# Altium schematic sheet SHA256.SchDoc
size A1
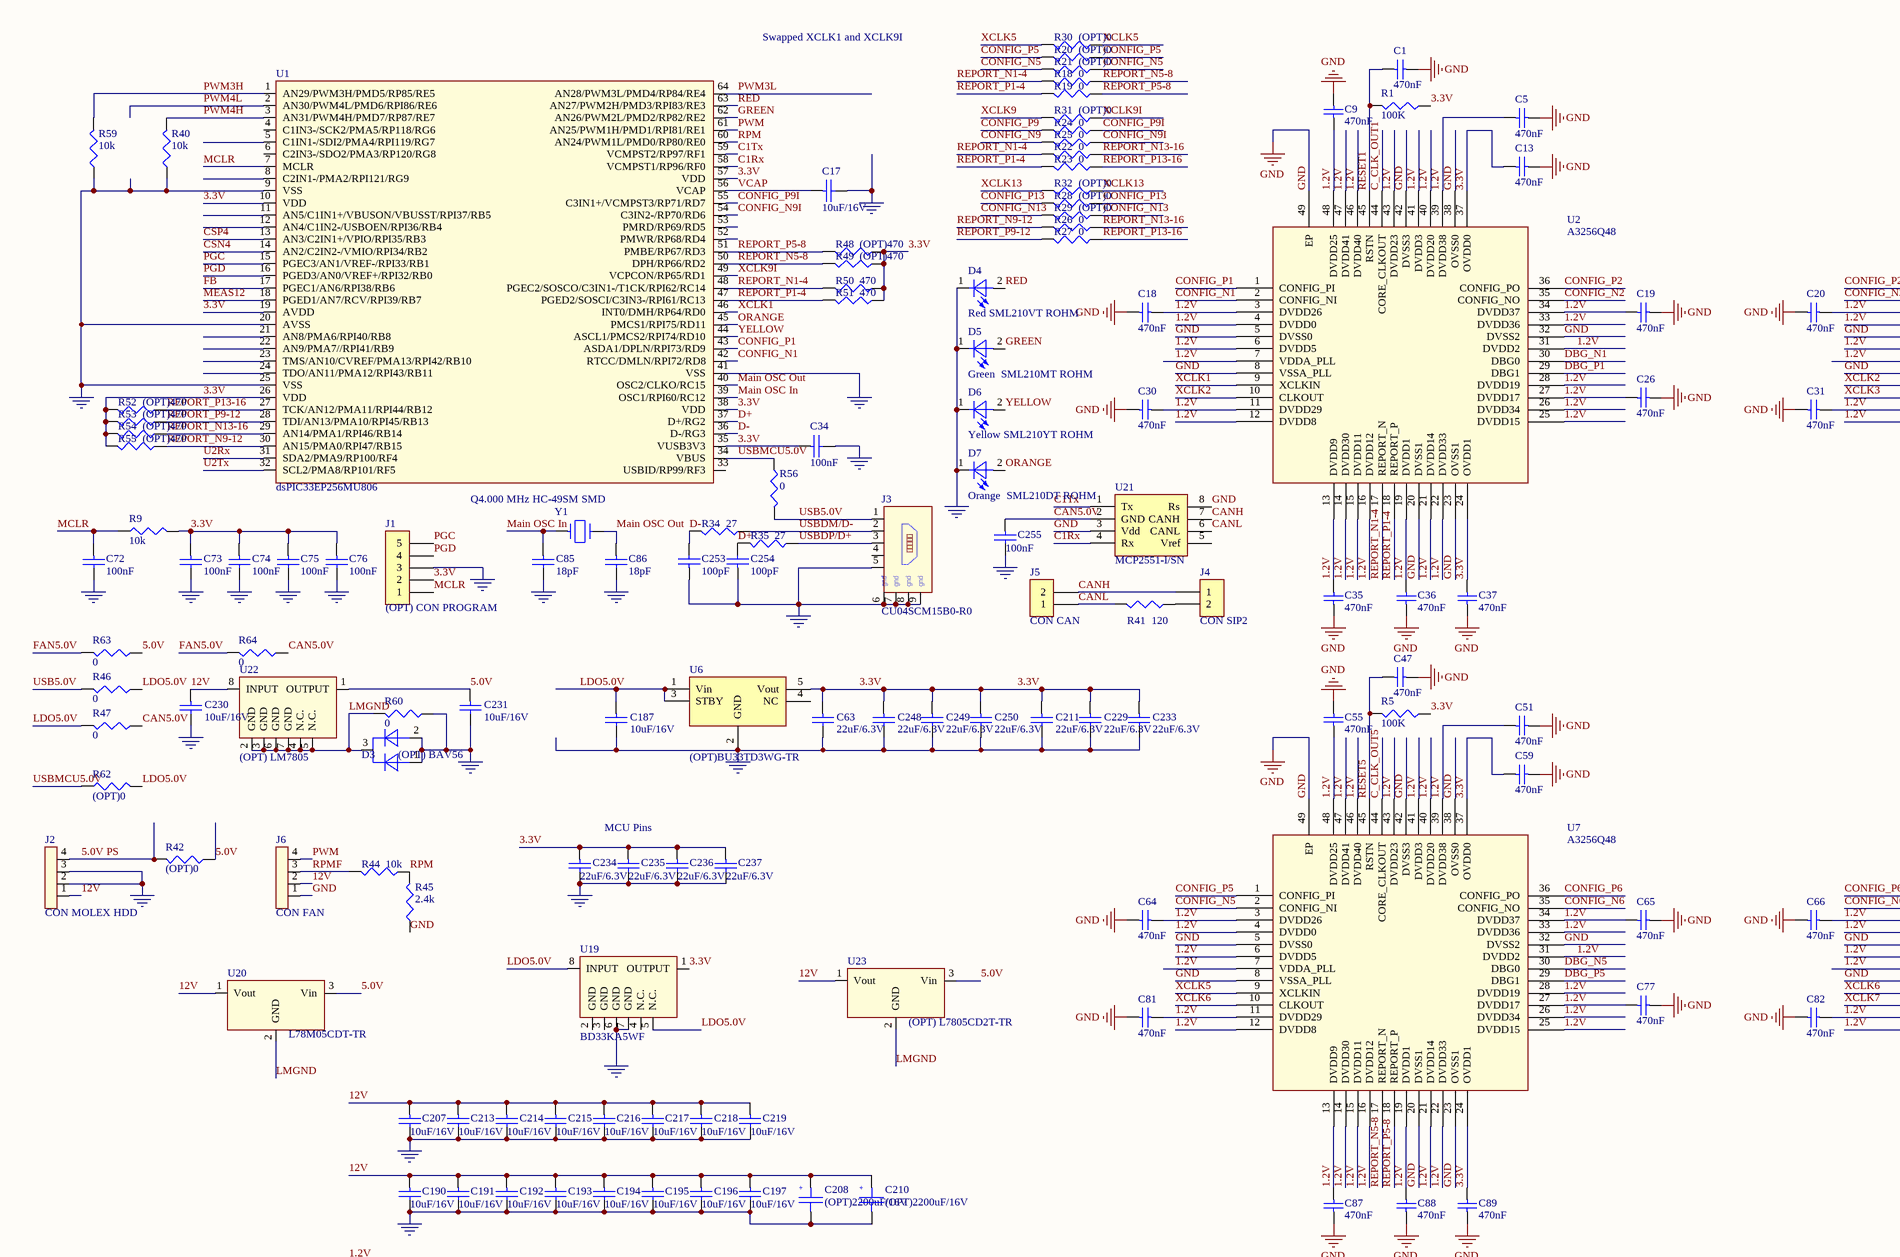
[diagram p0: SHA256.SchDoc, top left]
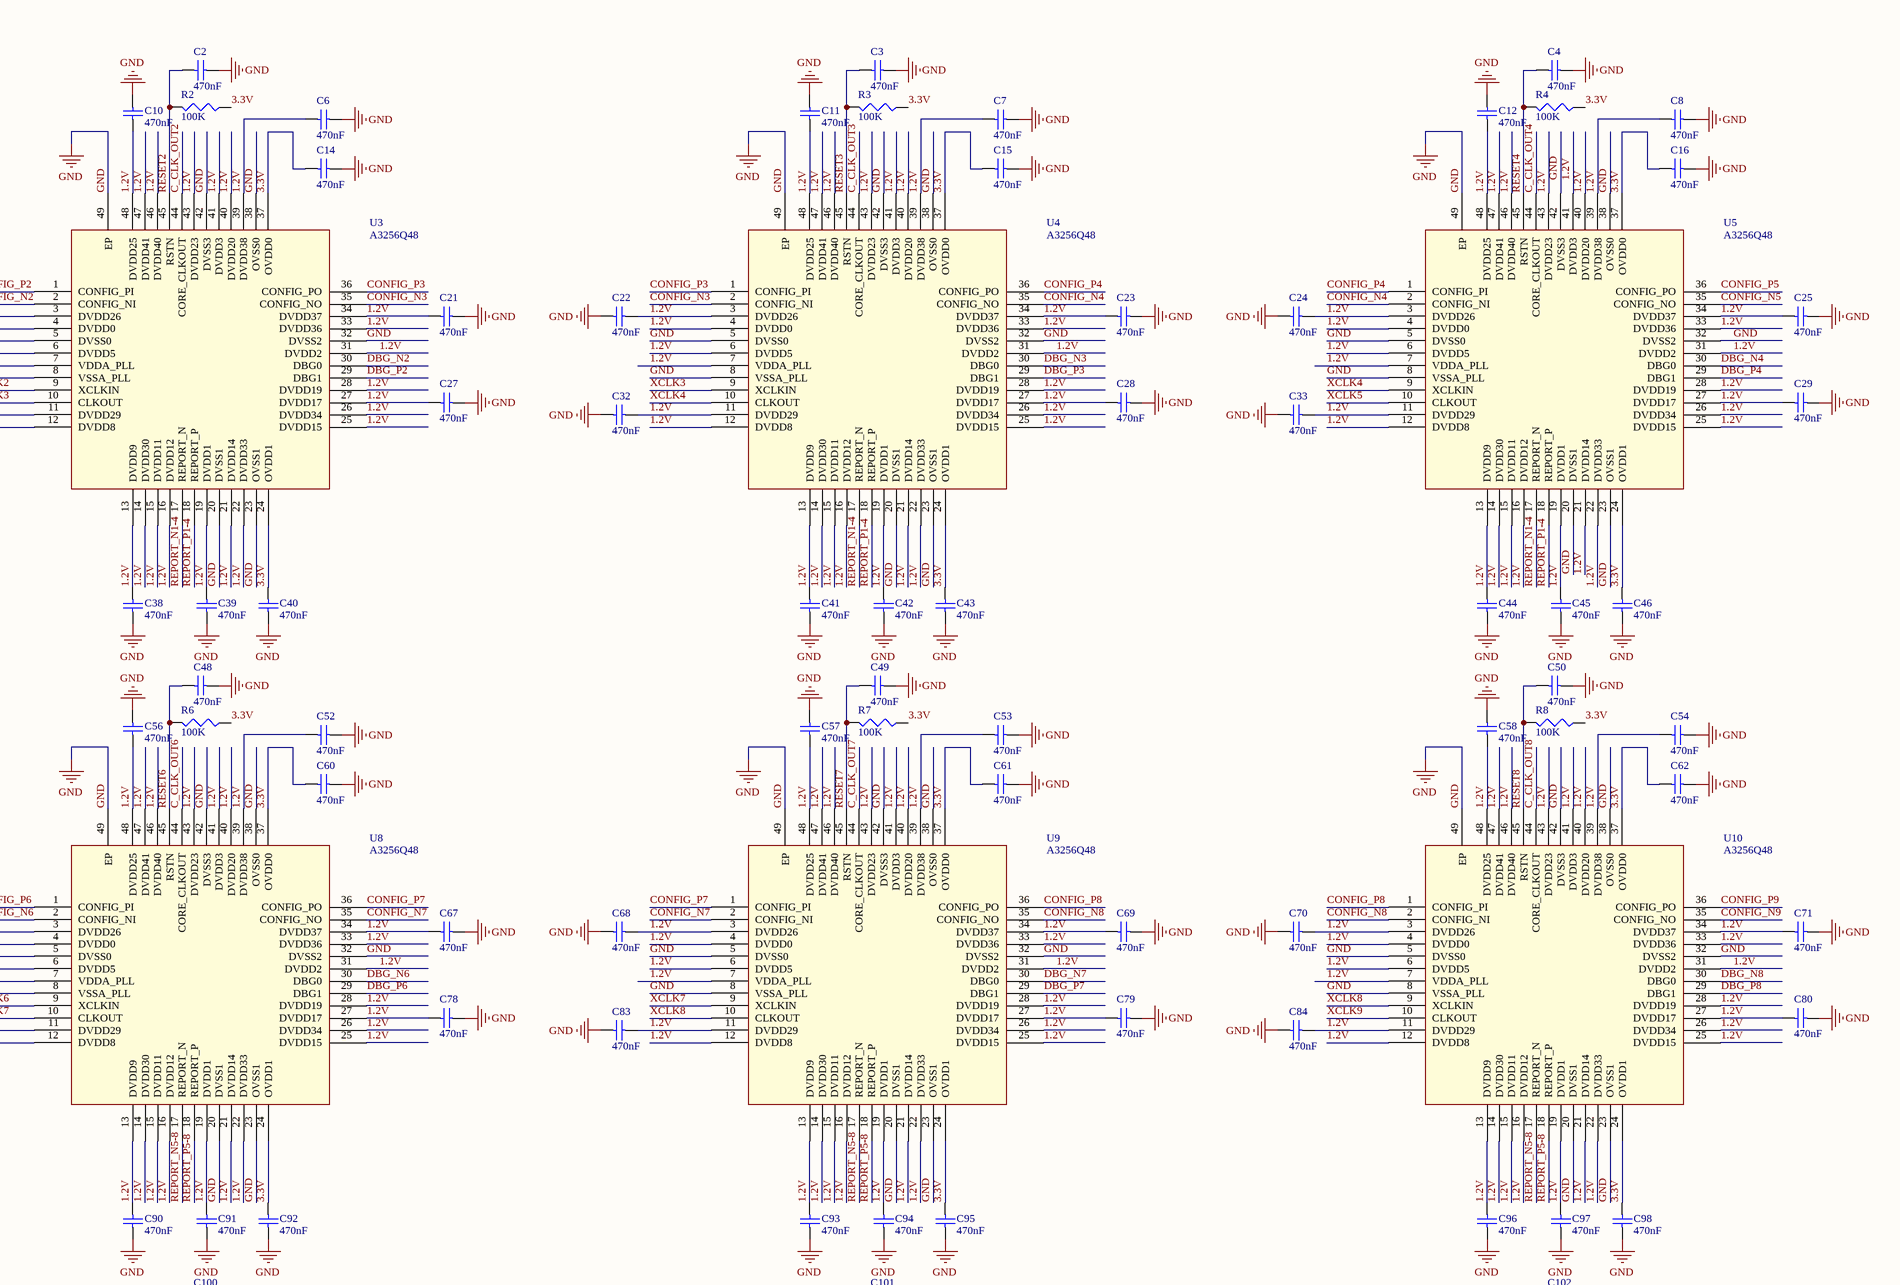
[diagram p1: SHA256.SchDoc, top right]
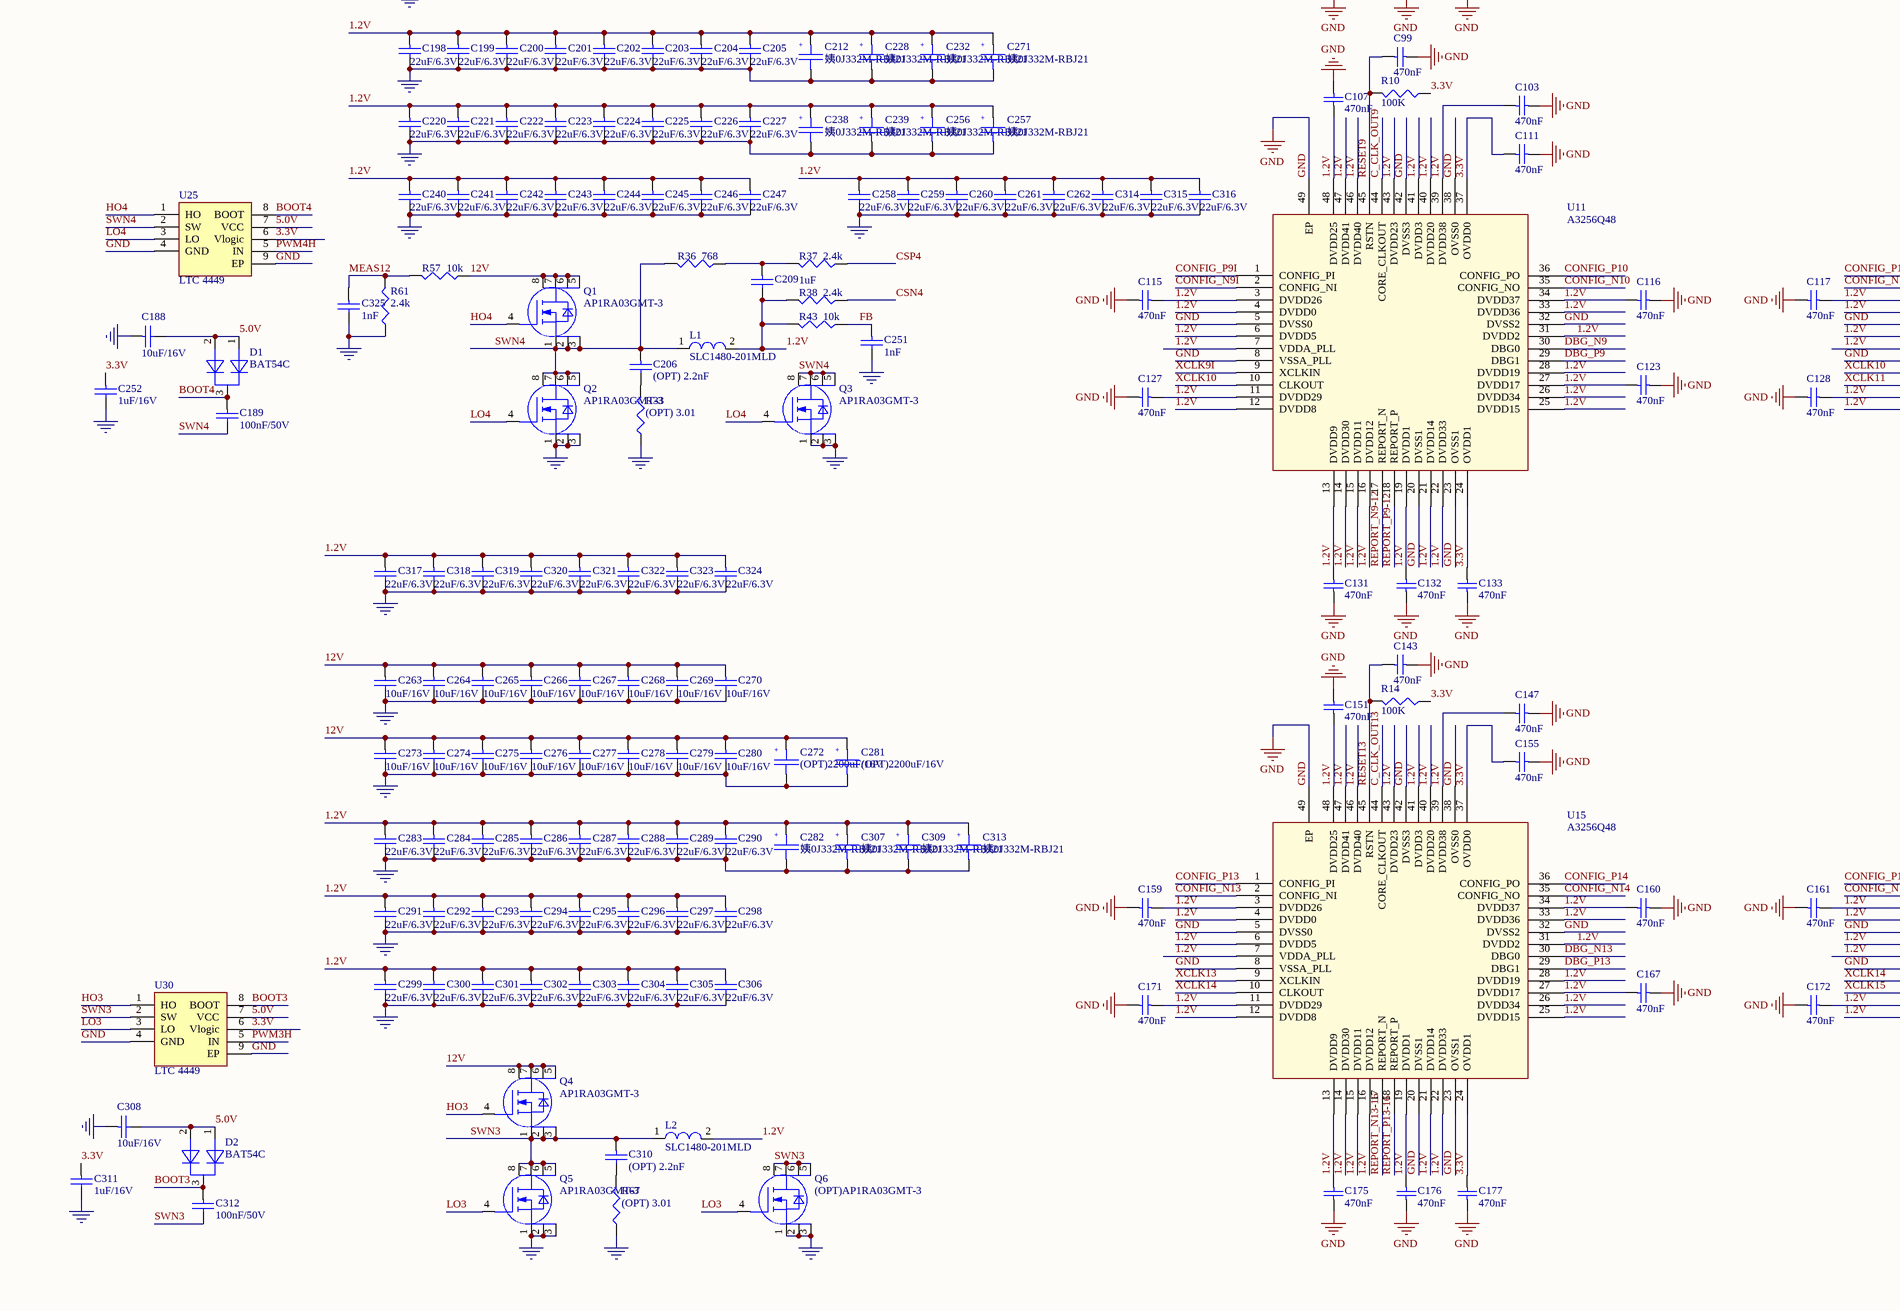
[diagram p2: SHA256.SchDoc, bottom left]
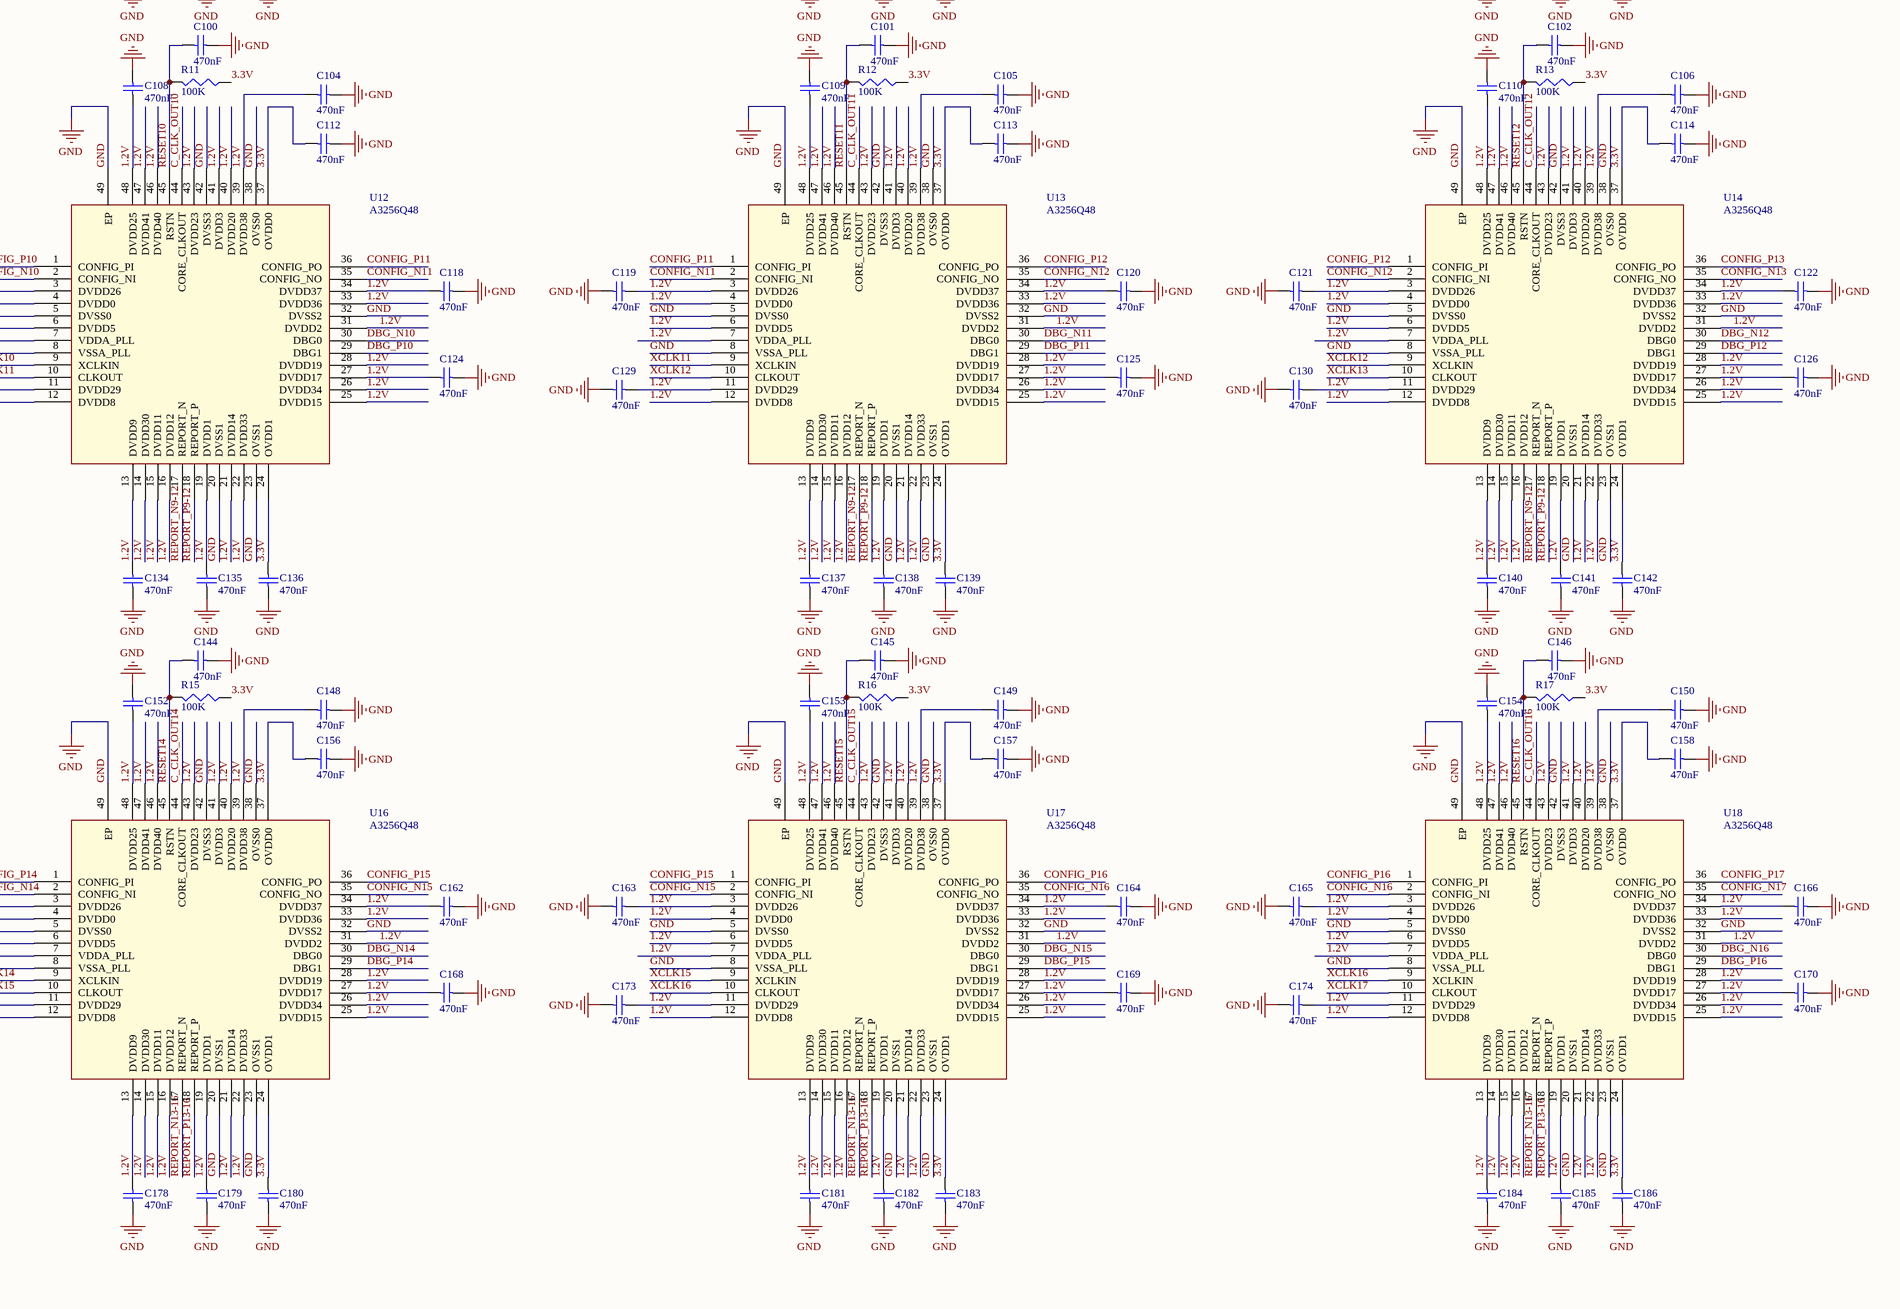
[diagram p3: SHA256.SchDoc, bottom right]

## Parts
C1  470nF  [SMD_0603_CAPC1608X80N]
C2  470nF  [SMD_0603_CAPC1608X80N]
C3  470nF  [SMD_0603_CAPC1608X80N]
C4  470nF  [SMD_0603_CAPC1608X80N]
C5  470nF  [SMD_0603_CAPC1608X80N]
C6  470nF  [SMD_0603_CAPC1608X80N]
C7  470nF  [SMD_0603_CAPC1608X80N]
C8  470nF  [SMD_0603_CAPC1608X80N]
C9  470nF  [SMD_0603_CAPC1608X80N]
C10  470nF  [SMD_0603_CAPC1608X80N]
C11  470nF  [SMD_0603_CAPC1608X80N]
C12  470nF  [SMD_0603_CAPC1608X80N]
C13  470nF  [SMD_0603_CAPC1608X80N]
C14  470nF  [SMD_0603_CAPC1608X80N]
C15  470nF  [SMD_0603_CAPC1608X80N]
C16  470nF  [SMD_0603_CAPC1608X80N]
C17  10uF/16V  [SMD_0805_CAPC2012X145N]
C18  470nF  [SMD_0603_CAPC1608X80N]
C19  470nF  [SMD_0603_CAPC1608X80N]
C20  470nF  [SMD_0603_CAPC1608X80N]
C21  470nF  [SMD_0603_CAPC1608X80N]
C22  470nF  [SMD_0603_CAPC1608X80N]
C23  470nF  [SMD_0603_CAPC1608X80N]
C24  470nF  [SMD_0603_CAPC1608X80N]
C25  470nF  [SMD_0603_CAPC1608X80N]
C26  470nF  [SMD_0603_CAPC1608X80N]
C27  470nF  [SMD_0603_CAPC1608X80N]
C28  470nF  [SMD_0603_CAPC1608X80N]
C29  470nF  [SMD_0603_CAPC1608X80N]
C30  470nF  [SMD_0603_CAPC1608X80N]
C31  470nF  [SMD_0603_CAPC1608X80N]
C32  470nF  [SMD_0603_CAPC1608X80N]
C33  470nF  [SMD_0603_CAPC1608X80N]
C34  100nF  [SMD_0603_CAPC1608X80N]
C35  470nF  [SMD_0603_CAPC1608X80N]
C36  470nF  [SMD_0603_CAPC1608X80N]
C37  470nF  [SMD_0603_CAPC1608X80N]
C38  470nF  [SMD_0603_CAPC1608X80N]
C39  470nF  [SMD_0603_CAPC1608X80N]
C40  470nF  [SMD_0603_CAPC1608X80N]
C41  470nF  [SMD_0603_CAPC1608X80N]
C42  470nF  [SMD_0603_CAPC1608X80N]
C43  470nF  [SMD_0603_CAPC1608X80N]
C44  470nF  [SMD_0603_CAPC1608X80N]
C45  470nF  [SMD_0603_CAPC1608X80N]
C46  470nF  [SMD_0603_CAPC1608X80N]
C47  470nF  [SMD_0603_CAPC1608X80N]
C48  470nF  [SMD_0603_CAPC1608X80N]
C49  470nF  [SMD_0603_CAPC1608X80N]
C50  470nF  [SMD_0603_CAPC1608X80N]
C51  470nF  [SMD_0603_CAPC1608X80N]
C52  470nF  [SMD_0603_CAPC1608X80N]
C53  470nF  [SMD_0603_CAPC1608X80N]
C54  470nF  [SMD_0603_CAPC1608X80N]
C55  470nF  [SMD_0603_CAPC1608X80N]
C56  470nF  [SMD_0603_CAPC1608X80N]
C57  470nF  [SMD_0603_CAPC1608X80N]
C58  470nF  [SMD_0603_CAPC1608X80N]
C59  470nF  [SMD_0603_CAPC1608X80N]
C60  470nF  [SMD_0603_CAPC1608X80N]
C61  470nF  [SMD_0603_CAPC1608X80N]
C62  470nF  [SMD_0603_CAPC1608X80N]
C63  22uF/6.3V  [SMD_0805_CAPC2012X145N]
C64  470nF  [SMD_0603_CAPC1608X80N]
C65  470nF  [SMD_0603_CAPC1608X80N]
C66  470nF  [SMD_0603_CAPC1608X80N]
C67  470nF  [SMD_0603_CAPC1608X80N]
C68  470nF  [SMD_0603_CAPC1608X80N]
C69  470nF  [SMD_0603_CAPC1608X80N]
C70  470nF  [SMD_0603_CAPC1608X80N]
C71  470nF  [SMD_0603_CAPC1608X80N]
C72  100nF  [SMD_0603_CAPC1608X80N]
C73  100nF  [SMD_0603_CAPC1608X80N]
C74  100nF  [SMD_0603_CAPC1608X80N]
C75  100nF  [SMD_0603_CAPC1608X80N]
C76  100nF  [SMD_0603_CAPC1608X80N]
C77  470nF  [SMD_0603_CAPC1608X80N]
C78  470nF  [SMD_0603_CAPC1608X80N]
C79  470nF  [SMD_0603_CAPC1608X80N]
C80  470nF  [SMD_0603_CAPC1608X80N]
C81  470nF  [SMD_0603_CAPC1608X80N]
C82  470nF  [SMD_0603_CAPC1608X80N]
C83  470nF  [SMD_0603_CAPC1608X80N]
C84  470nF  [SMD_0603_CAPC1608X80N]
C85  18pF  [SMD_0603_CAPC1608X80N]
C86  18pF  [SMD_0603_CAPC1608X80N]
C87  470nF  [SMD_0603_CAPC1608X80N]
C88  470nF  [SMD_0603_CAPC1608X80N]
C89  470nF  [SMD_0603_CAPC1608X80N]
C90  470nF  [SMD_0603_CAPC1608X80N]
C91  470nF  [SMD_0603_CAPC1608X80N]
C92  470nF  [SMD_0603_CAPC1608X80N]
C93  470nF  [SMD_0603_CAPC1608X80N]
C94  470nF  [SMD_0603_CAPC1608X80N]
C95  470nF  [SMD_0603_CAPC1608X80N]
C96  470nF  [SMD_0603_CAPC1608X80N]
C97  470nF  [SMD_0603_CAPC1608X80N]
C98  470nF  [SMD_0603_CAPC1608X80N]
C99  470nF  [SMD_0603_CAPC1608X80N]
C100  470nF  [SMD_0603_CAPC1608X80N]
C101  470nF  [SMD_0603_CAPC1608X80N]
C102  470nF  [SMD_0603_CAPC1608X80N]
C103  470nF  [SMD_0603_CAPC1608X80N]
C104  470nF  [SMD_0603_CAPC1608X80N]
C105  470nF  [SMD_0603_CAPC1608X80N]
C106  470nF  [SMD_0603_CAPC1608X80N]
C107  470nF  [SMD_0603_CAPC1608X80N]
C108  470nF  [SMD_0603_CAPC1608X80N]
C109  470nF  [SMD_0603_CAPC1608X80N]
C110  470nF  [SMD_0603_CAPC1608X80N]
C111  470nF  [SMD_0603_CAPC1608X80N]
C112  470nF  [SMD_0603_CAPC1608X80N]
C113  470nF  [SMD_0603_CAPC1608X80N]
C114  470nF  [SMD_0603_CAPC1608X80N]
C115  470nF  [SMD_0603_CAPC1608X80N]
C116  470nF  [SMD_0603_CAPC1608X80N]
C117  470nF  [SMD_0603_CAPC1608X80N]
C118  470nF  [SMD_0603_CAPC1608X80N]
C119  470nF  [SMD_0603_CAPC1608X80N]
C120  470nF  [SMD_0603_CAPC1608X80N]
C121  470nF  [SMD_0603_CAPC1608X80N]
C122  470nF  [SMD_0603_CAPC1608X80N]
C123  470nF  [SMD_0603_CAPC1608X80N]
C124  470nF  [SMD_0603_CAPC1608X80N]
C125  470nF  [SMD_0603_CAPC1608X80N]
C126  470nF  [SMD_0603_CAPC1608X80N]
C127  470nF  [SMD_0603_CAPC1608X80N]
C128  470nF  [SMD_0603_CAPC1608X80N]
C129  470nF  [SMD_0603_CAPC1608X80N]
C130  470nF  [SMD_0603_CAPC1608X80N]
C131  470nF  [SMD_0603_CAPC1608X80N]
C132  470nF  [SMD_0603_CAPC1608X80N]
C133  470nF  [SMD_0603_CAPC1608X80N]
C134  470nF  [SMD_0603_CAPC1608X80N]
C135  470nF  [SMD_0603_CAPC1608X80N]
C136  470nF  [SMD_0603_CAPC1608X80N]
C137  470nF  [SMD_0603_CAPC1608X80N]
C138  470nF  [SMD_0603_CAPC1608X80N]
C139  470nF  [SMD_0603_CAPC1608X80N]
C140  470nF  [SMD_0603_CAPC1608X80N]
C141  470nF  [SMD_0603_CAPC1608X80N]
C142  470nF  [SMD_0603_CAPC1608X80N]
C143  470nF  [SMD_0603_CAPC1608X80N]
C144  470nF  [SMD_0603_CAPC1608X80N]
C145  470nF  [SMD_0603_CAPC1608X80N]
C146  470nF  [SMD_0603_CAPC1608X80N]
C147  470nF  [SMD_0603_CAPC1608X80N]
C148  470nF  [SMD_0603_CAPC1608X80N]
C149  470nF  [SMD_0603_CAPC1608X80N]
C150  470nF  [SMD_0603_CAPC1608X80N]
C151  470nF  [SMD_0603_CAPC1608X80N]
C152  470nF  [SMD_0603_CAPC1608X80N]
C153  470nF  [SMD_0603_CAPC1608X80N]
C154  470nF  [SMD_0603_CAPC1608X80N]
C155  470nF  [SMD_0603_CAPC1608X80N]
C156  470nF  [SMD_0603_CAPC1608X80N]
C157  470nF  [SMD_0603_CAPC1608X80N]
C158  470nF  [SMD_0603_CAPC1608X80N]
C159  470nF  [SMD_0603_CAPC1608X80N]
C160  470nF  [SMD_0603_CAPC1608X80N]
C161  470nF  [SMD_0603_CAPC1608X80N]
C162  470nF  [SMD_0603_CAPC1608X80N]
C163  470nF  [SMD_0603_CAPC1608X80N]
C164  470nF  [SMD_0603_CAPC1608X80N]
C165  470nF  [SMD_0603_CAPC1608X80N]
C166  470nF  [SMD_0603_CAPC1608X80N]
C167  470nF  [SMD_0603_CAPC1608X80N]
C168  470nF  [SMD_0603_CAPC1608X80N]
C169  470nF  [SMD_0603_CAPC1608X80N]
C170  470nF  [SMD_0603_CAPC1608X80N]
C171  470nF  [SMD_0603_CAPC1608X80N]
C172  470nF  [SMD_0603_CAPC1608X80N]
C173  470nF  [SMD_0603_CAPC1608X80N]
C174  470nF  [SMD_0603_CAPC1608X80N]
C175  470nF  [SMD_0603_CAPC1608X80N]
C176  470nF  [SMD_0603_CAPC1608X80N]
C177  470nF  [SMD_0603_CAPC1608X80N]
C178  470nF  [SMD_0603_CAPC1608X80N]
C179  470nF  [SMD_0603_CAPC1608X80N]
C180  470nF  [SMD_0603_CAPC1608X80N]
C181  470nF  [SMD_0603_CAPC1608X80N]
C182  470nF  [SMD_0603_CAPC1608X80N]
C183  470nF  [SMD_0603_CAPC1608X80N]
C184  470nF  [SMD_0603_CAPC1608X80N]
C185  470nF  [SMD_0603_CAPC1608X80N]
C186  470nF  [SMD_0603_CAPC1608X80N]
C187  10uF/16V  [SMD_0805_CAPC2012X145N]
C188  10uF/16V  [SMD_0805_CAPC2012X145N]
C189  100nF/50V  [SMD_0805_CAPC2012X145N]
C190  10uF/16V  [SMD_0805_CAPC2012X145N]
C191  10uF/16V  [SMD_0805_CAPC2012X145N]
C192  10uF/16V  [SMD_0805_CAPC2012X145N]
C193  10uF/16V  [SMD_0805_CAPC2012X145N]
C194  10uF/16V  [SMD_0805_CAPC2012X145N]
C195  10uF/16V  [SMD_0805_CAPC2012X145N]
C196  10uF/16V  [SMD_0805_CAPC2012X145N]
C197  10uF/16V  [SMD_0805_CAPC2012X145N]
C198  22uF/6.3V  [SMD_0805_CAPC2012X145N]
C199  22uF/6.3V  [SMD_0805_CAPC2012X145N]
C200  22uF/6.3V  [SMD_0805_CAPC2012X145N]
C201  22uF/6.3V  [SMD_0805_CAPC2012X145N]
C202  22uF/6.3V  [SMD_0805_CAPC2012X145N]
C203  22uF/6.3V  [SMD_0805_CAPC2012X145N]
C204  22uF/6.3V  [SMD_0805_CAPC2012X145N]
C205  22uF/6.3V  [SMD_0805_CAPC2012X145N]
C206  (OPT) 2.2nF  [SMD_0805_CAPC2012X145N]
C207  10uF/16V  [SMD_0805_CAPC2012X145N]
C208  (OPT)2200uF/16V  [PTH_CAPPR500-1300X2250]
C209  1uF  [SMD_0805_CAPC2012X145N]
C210  (OPT)2200uF/16V  [PTH_CAPPR500-1300X2250]
C211  22uF/6.3V  [SMD_0805_CAPC2012X145N]
C212  姨0J332M-RBJ21  [PTH_CAPPR500-1300X2250]
C213  10uF/16V  [SMD_0805_CAPC2012X145N]
C214  10uF/16V  [SMD_0805_CAPC2012X145N]
C215  10uF/16V  [SMD_0805_CAPC2012X145N]
C216  10uF/16V  [SMD_0805_CAPC2012X145N]
C217  10uF/16V  [SMD_0805_CAPC2012X145N]
C218  10uF/16V  [SMD_0805_CAPC2012X145N]
C219  10uF/16V  [SMD_0805_CAPC2012X145N]
C220  22uF/6.3V  [SMD_0805_CAPC2012X145N]
C221  22uF/6.3V  [SMD_0805_CAPC2012X145N]
C222  22uF/6.3V  [SMD_0805_CAPC2012X145N]
C223  22uF/6.3V  [SMD_0805_CAPC2012X145N]
C224  22uF/6.3V  [SMD_0805_CAPC2012X145N]
C225  22uF/6.3V  [SMD_0805_CAPC2012X145N]
C226  22uF/6.3V  [SMD_0805_CAPC2012X145N]
C227  22uF/6.3V  [SMD_0805_CAPC2012X145N]
C228  姨0J332M-RBJ21  [PTH_CAPPR500-1300X2250]
C229  22uF/6.3V  [SMD_0805_CAPC2012X145N]
C230  10uF/16V  [SMD_0805_CAPC2012X145N]
C231  10uF/16V  [SMD_0805_CAPC2012X145N]
C232  姨0J332M-RBJ21  [PTH_CAPPR500-1300X2250]
C233  22uF/6.3V  [SMD_0805_CAPC2012X145N]
C234  22uF/6.3V  [SMD_0805_CAPC2012X145N]
C235  22uF/6.3V  [SMD_0805_CAPC2012X145N]
C236  22uF/6.3V  [SMD_0805_CAPC2012X145N]
C237  22uF/6.3V  [SMD_0805_CAPC2012X145N]
C238  姨0J332M-RBJ21  [PTH_CAPPR500-1300X2250]
C239  姨0J332M-RBJ21  [PTH_CAPPR500-1300X2250]
C240  22uF/6.3V  [SMD_0805_CAPC2012X145N]
C241  22uF/6.3V  [SMD_0805_CAPC2012X145N]
C242  22uF/6.3V  [SMD_0805_CAPC2012X145N]
C243  22uF/6.3V  [SMD_0805_CAPC2012X145N]
C244  22uF/6.3V  [SMD_0805_CAPC2012X145N]
C245  22uF/6.3V  [SMD_0805_CAPC2012X145N]
C246  22uF/6.3V  [SMD_0805_CAPC2012X145N]
C247  22uF/6.3V  [SMD_0805_CAPC2012X145N]
C248  22uF/6.3V  [SMD_0805_CAPC2012X145N]
C249  22uF/6.3V  [SMD_0805_CAPC2012X145N]
C250  22uF/6.3V  [SMD_0805_CAPC2012X145N]
C251  1nF  [SMD_0603_CAPC1608X80N]
C252  1uF/16V  [SMD_0805_CAPC2012X145N]
C253  100pF  [SMD_0603_CAPC1608X80N]
C254  100pF  [SMD_0603_CAPC1608X80N]
C255  100nF  [SMD_0603_CAPC1608X80N]
C256  姨0J332M-RBJ21  [PTH_CAPPR500-1300X2250]
C257  姨0J332M-RBJ21  [PTH_CAPPR500-1300X2250]
C258  22uF/6.3V  [SMD_0805_CAPC2012X145N]
C259  22uF/6.3V  [SMD_0805_CAPC2012X145N]
C260  22uF/6.3V  [SMD_0805_CAPC2012X145N]
C261  22uF/6.3V  [SMD_0805_CAPC2012X145N]
C262  22uF/6.3V  [SMD_0805_CAPC2012X145N]
C263  10uF/16V  [SMD_0805_CAPC2012X145N]
C264  10uF/16V  [SMD_0805_CAPC2012X145N]
C265  10uF/16V  [SMD_0805_CAPC2012X145N]
C266  10uF/16V  [SMD_0805_CAPC2012X145N]
C267  10uF/16V  [SMD_0805_CAPC2012X145N]
C268  10uF/16V  [SMD_0805_CAPC2012X145N]
C269  10uF/16V  [SMD_0805_CAPC2012X145N]
C270  10uF/16V  [SMD_0805_CAPC2012X145N]
C271  姨0J332M-RBJ21  [PTH_CAPPR500-1300X2250]
C272  (OPT)2200uF/16V  [PTH_CAPPR500-1300X2250]
C273  10uF/16V  [SMD_0805_CAPC2012X145N]
C274  10uF/16V  [SMD_0805_CAPC2012X145N]
C275  10uF/16V  [SMD_0805_CAPC2012X145N]
C276  10uF/16V  [SMD_0805_CAPC2012X145N]
C277  10uF/16V  [SMD_0805_CAPC2012X145N]
C278  10uF/16V  [SMD_0805_CAPC2012X145N]
C279  10uF/16V  [SMD_0805_CAPC2012X145N]
C280  10uF/16V  [SMD_0805_CAPC2012X145N]
C281  (OPT)2200uF/16V  [PTH_CAPPR500-1300X2250]
C282  姨0J332M-RBJ21  [PTH_CAPPR500-1300X2250]
C283  22uF/6.3V  [SMD_0805_CAPC2012X145N]
C284  22uF/6.3V  [SMD_0805_CAPC2012X145N]
C285  22uF/6.3V  [SMD_0805_CAPC2012X145N]
C286  22uF/6.3V  [SMD_0805_CAPC2012X145N]
C287  22uF/6.3V  [SMD_0805_CAPC2012X145N]
C288  22uF/6.3V  [SMD_0805_CAPC2012X145N]
C289  22uF/6.3V  [SMD_0805_CAPC2012X145N]
C290  22uF/6.3V  [SMD_0805_CAPC2012X145N]
C291  22uF/6.3V  [SMD_0805_CAPC2012X145N]
C292  22uF/6.3V  [SMD_0805_CAPC2012X145N]
C293  22uF/6.3V  [SMD_0805_CAPC2012X145N]
C294  22uF/6.3V  [SMD_0805_CAPC2012X145N]
C295  22uF/6.3V  [SMD_0805_CAPC2012X145N]
C296  22uF/6.3V  [SMD_0805_CAPC2012X145N]
C297  22uF/6.3V  [SMD_0805_CAPC2012X145N]
C298  22uF/6.3V  [SMD_0805_CAPC2012X145N]
C299  22uF/6.3V  [SMD_0805_CAPC2012X145N]
C300  22uF/6.3V  [SMD_0805_CAPC2012X145N]
C301  22uF/6.3V  [SMD_0805_CAPC2012X145N]
C302  22uF/6.3V  [SMD_0805_CAPC2012X145N]
C303  22uF/6.3V  [SMD_0805_CAPC2012X145N]
C304  22uF/6.3V  [SMD_0805_CAPC2012X145N]
C305  22uF/6.3V  [SMD_0805_CAPC2012X145N]
C306  22uF/6.3V  [SMD_0805_CAPC2012X145N]
C307  姨0J332M-RBJ21  [PTH_CAPPR500-1300X2250]
C308  10uF/16V  [SMD_0805_CAPC2012X145N]
C309  姨0J332M-RBJ21  [PTH_CAPPR500-1300X2250]
C310  (OPT) 2.2nF  [SMD_0805_CAPC2012X145N]
C311  1uF/16V  [SMD_0805_CAPC2012X145N]
C312  100nF/50V  [SMD_0805_CAPC2012X145N]
C313  姨0J332M-RBJ21  [PTH_CAPPR500-1300X2250]
C314  22uF/6.3V  [SMD_0805_CAPC2012X145N]
C315  22uF/6.3V  [SMD_0805_CAPC2012X145N]
C316  22uF/6.3V  [SMD_0805_CAPC2012X145N]
C317  22uF/6.3V  [SMD_0805_CAPC2012X145N]
C318  22uF/6.3V  [SMD_0805_CAPC2012X145N]
C319  22uF/6.3V  [SMD_0805_CAPC2012X145N]
C320  22uF/6.3V  [SMD_0805_CAPC2012X145N]
C321  22uF/6.3V  [SMD_0805_CAPC2012X145N]
C322  22uF/6.3V  [SMD_0805_CAPC2012X145N]
C323  22uF/6.3V  [SMD_0805_CAPC2012X145N]
C324  22uF/6.3V  [SMD_0805_CAPC2012X145N]
C325  1nF  [SMD_0603_CAPC1608X80N]
D1  BAT54C  [SMD_SOT23_SOT95P240X120-3N]
D2  BAT54C  [SMD_SOT23_SOT95P240X120-3N]
D3  (OPT) BAV56  [SMD_SOT23_SOT95P240X120-3N]
D4  Red SML210VT ROHM  [SMD_0805_LED2012X100N]
D5  Green 	SML210MT ROHM  [SMD_0805_LED2012X100N]
D6  Yellow SML210YT ROHM  [SMD_0805_LED2012X100N]
D7  Orange 	SML210DT ROHM  [SMD_0805_LED2012X100N]
J1  (OPT) CON PROGRAM  [SIP5 PGM TOP]
J2  CON MOLEX HDD  [MOLEX_PWR_4P - AVALON]
J3  CU04SCM15B0-R0  [SMD_CON-CVILUX-CU04-SCM15B0]
J4  CON SIP2  [PTH_HDRV02W64P254_1X02]
J5  CON CAN  [PTH_CON_JST-B2PS-VH]
J6  CON FAN  [PTH_CON_PANCON-MPSS100-04D]
L1  SLC1480-201MLD  [SMD_INDM12501250X800A - Coilcraft SLC1480]
L2  SLC1480-201MLD  [SMD_INDM12501250X800A - Coilcraft SLC1480]
Q1  AP1RA03GMT-3  [SMD_SON127P615X520X100-8N]
Q2  AP1RA03GMT-3  [SMD_SON127P615X520X100-8N]
Q3  AP1RA03GMT-3  [SMD_SON127P615X520X100-8N]
Q4  AP1RA03GMT-3  [SMD_SON127P615X520X100-8N]
Q5  AP1RA03GMT-3  [SMD_SON127P615X520X100-8N]
Q6  (OPT)AP1RA03GMT-3  [SMD_SON127P615X520X100-8N]
R1  100K  [SMD_0603_RESC1608X55N]
R2  100K  [SMD_0603_RESC1608X55N]
R3  100K  [SMD_0603_RESC1608X55N]
R4  100K  [SMD_0603_RESC1608X55N]
R5  100K  [SMD_0603_RESC1608X55N]
R6  100K  [SMD_0603_RESC1608X55N]
R7  100K  [SMD_0603_RESC1608X55N]
R8  100K  [SMD_0603_RESC1608X55N]
R9  10k  [SMD_0603_RESC1608X55N]
R10  100K  [SMD_0603_RESC1608X55N]
R11  100K  [SMD_0603_RESC1608X55N]
R12  100K  [SMD_0603_RESC1608X55N]
R13  100K  [SMD_0603_RESC1608X55N]
R14  100K  [SMD_0603_RESC1608X55N]
R15  100K  [SMD_0603_RESC1608X55N]
R16  100K  [SMD_0603_RESC1608X55N]
R17  100K  [SMD_0603_RESC1608X55N]
R18  0  [SMD_0603_RESC1608X55N]
R19  0  [SMD_0603_RESC1608X55N]
R20  (OPT)0  [SMD_0603_RESC1608X55N]
R21  (OPT)0  [SMD_0603_RESC1608X55N]
R22  0  [SMD_0603_RESC1608X55N]
R23  0  [SMD_0603_RESC1608X55N]
R24  0  [SMD_0603_RESC1608X55N]
R25  0  [SMD_0603_RESC1608X55N]
R26  0  [SMD_0603_RESC1608X55N]
R27  0  [SMD_0603_RESC1608X55N]
R28  (OPT)0  [SMD_0603_RESC1608X55N]
R29  (OPT)0  [SMD_0603_RESC1608X55N]
R30  (OPT)0  [SMD_0603_RESC1608X55N]
R31  (OPT)0  [SMD_0603_RESC1608X55N]
R32  (OPT)0  [SMD_0603_RESC1608X55N]
R33  (OPT) 3.01  [SMD_1206_RESC3216X180N]
R34  27  [SMD_0603_RESC1608X55N]
R35  27  [SMD_0603_RESC1608X55N]
R36  768  [SMD_0603_RESC1608X55N]
R37  2.4k  [SMD_0603_RESC1608X55N]
R38  2.4k  [SMD_0603_RESC1608X55N]
R40  10k  [SMD_0603_RESC1608X55N]
R41  120  [SMD_0603_RESC1608X55N]
R42  (OPT)0  [SMD_0603_RESC1608X55N]
R43  10k  [SMD_0603_RESC1608X55N]
R44  10k  [SMD_0603_RESC1608X55N]
R45  2.4k  [SMD_0603_RESC1608X55N]
R46  0  [SMD_1206_RESC3216X180N]
R47  0  [SMD_1206_RESC3216X180N]
R48  (OPT)470  [SMD_0603_RESC1608X55N]
R49  (OPT)470  [SMD_0603_RESC1608X55N]
R50  470  [SMD_0603_RESC1608X55N]
R51  470  [SMD_0603_RESC1608X55N]
R52  (OPT)470  [SMD_0603_RESC1608X55N]
R53  (OPT)470  [SMD_0603_RESC1608X55N]
R54  (OPT)470  [SMD_0603_RESC1608X55N]
R55  (OPT)470  [SMD_0603_RESC1608X55N]
R56  0  [SMD_0603_RESC1608X55N]
R57  10k  [SMD_0603_RESC1608X55N]
R59  10k  [SMD_0603_RESC1608X55N]
R60  0  [SMD_1206_RESC3216X180N]
R61  2.4k  [SMD_0603_RESC1608X55N]
R62  (OPT)0  [SMD_0603_RESC1608X55N]
R63  0  [SMD_0603_RESC1608X55N]
R64  0  [SMD_0603_RESC1608X55N]
R67  (OPT) 3.01  [SMD_1206_RESC3216X180N]
U1  dsPIC33EP256MU806  [SMD_QFP50P1200X1200X120-64N]
U2  A3256Q48  [SMD_QFN50P700X700X90-49N]
U3  A3256Q48  [SMD_QFN50P700X700X90-49N]
U4  A3256Q48  [SMD_QFN50P700X700X90-49N]
U5  A3256Q48  [SMD_QFN50P700X700X90-49N]
U6  (OPT)BU33TD3WG-TR  [SMD_SOT26_SOT95P285X140-5N - DLV]
U7  A3256Q48  [SMD_QFN50P700X700X90-49N]
U8  A3256Q48  [SMD_QFN50P700X700X90-49N]
U9  A3256Q48  [SMD_QFN50P700X700X90-49N]
U10  A3256Q48  [SMD_QFN50P700X700X90-49N]
U11  A3256Q48  [SMD_QFN50P700X700X90-49N]
U12  A3256Q48  [SMD_QFN50P700X700X90-49N]
U13  A3256Q48  [SMD_QFN50P700X700X90-49N]
U14  A3256Q48  [SMD_QFN50P700X700X90-49N]
U15  A3256Q48  [SMD_QFN50P700X700X90-49N]
U16  A3256Q48  [SMD_QFN50P700X700X90-49N]
U17  A3256Q48  [SMD_QFN50P700X700X90-49N]
U18  A3256Q48  [SMD_QFN50P700X700X90-49N]
U19  BD33KA5WF  [SMD_SOIC127P602X173-8N]
U20  L78M05CDT-TR  [SMD_TO229P991X239-4AN_DPAK]
U21  MCP2551-I/SN  [SMD_SOIC127P602X173-8N]
U22  (OPT) LM7805  [SMD_SOIC127P602X173-8N]
U23  (OPT) L7805CD2T-TR  [SMD_TO254P1524X483-3_4N_D2PAK + DPAK]
U25  LTC 4449  [SMD_SOP65P490X110-9N - DUAL]
U30  LTC 4449  [SMD_SOP65P490X110-9N - DUAL]
Y1  Q4.000 MHz HC-49SM SMD  [SMD_HC49_XTAL1140X480X420N]

## Nets
GND: C1.2 C2.2 C3.2 C4.2 C5.2 C6.2 C7.2 C8.2 C9.2 C10.2 C11.2 C12.2 C13.2 C14.2 C15.2 C16.2 C17.2 C18.2 C19.2 C20.2 C21.2 C22.2 C23.2 C24.2 C25.2 C26.2 C27.2 C28.2 C29.2 C30.2 C31.2 C32.2 C33.2 C34.2 C35.2 C36.2 C37.1 C38.2 C39.2 C40.1 C41.2 C42.2 C43.1 C44.2 C45.2 C46.1 C47.2 C48.2 C49.2 C50.2 C51.2 C52.2 C53.2 C54.2 C55.2 C56.2 C57.2 C58.2 C59.2 C60.2 C61.2 C62.2 C63.2 C64.2 C65.2 C66.2 C67.2 C68.2 C69.2 C70.2 C71.2 C72.2 C73.2 C74.2 C75.2 C76.2 C77.2 C78.2 C79.2 C80.2 C81.2 C82.2 C83.2 C84.2 C85.2 C86.2 C87.2 C88.2 C89.1 C90.2 C91.2 C92.1 C93.2 C94.2 C95.1 C96.2 C97.2 C98.1 C99.2 C100.2 C101.2 C102.2 C103.2 C104.2 C105.2 C106.2 C107.2 C108.2 C109.2 C110.2 C111.2 C112.2 C113.2 C114.2 C115.2 C116.2 C117.2 C118.2 C119.2 C120.2 C121.2 C122.2 C123.2 C124.2 C125.2 C126.2 C127.2 C128.2 C129.2 C130.2 C131.2 C132.2 C133.1 C134.2 C135.2 C136.1 C137.2 C138.2 C139.1 C140.2 C141.2 C142.1 C143.2 C144.2 C145.2 C146.2 C147.2 C148.2 C149.2 C150.2 C151.2 C152.2 C153.2 C154.2 C155.2 C156.2 C157.2 C158.2 C159.2 C160.2 C161.2 C162.2 C163.2 C164.2 C165.2 C166.2 C167.2 C168.2 C169.2 C170.2 C171.2 C172.2 C173.2 C174.2 C175.2 C176.2 C177.1 C178.2 C179.2 C180.1 C181.2 C182.2 C183.1 C184.2 C185.2 C186.1 C187.2 C188.1 C190.2 C191.2 C192.2 C193.2 C194.2 C195.2 C196.2 C197.2 C198.2 C199.2 C200.2 C201.2 C202.2 C203.2 C204.2 C205.2 C207.2 C208.2 C210.2 C211.2 C212.2 C213.2 C214.2 C215.2 C216.2 C217.2 C218.2 C219.2 C220.2 C221.2 C222.2 C223.2 C224.2 C225.2 C226.2 C227.2 C228.2 C229.2 C230.2 C231.2 C232.2 C233.2 C234.2 C235.2 C236.2 C237.2 C238.2 C239.2 C240.2 C241.2 C242.2 C243.2 C244.2 C245.2 C246.2 C247.2 C248.2 C249.2 C250.2 C251.2 C252.2 C253.1 C254.1 C255.2 C256.2 C257.2 C258.2 C259.2 C260.2 C261.2 C262.2 C263.2 C264.2 C265.2 C266.2 C267.2 C268.2 C269.2 C270.2 C271.2 C272.2 C273.2 C274.2 C275.2 C276.2 C277.2 C278.2 C279.2 C280.2 C281.2 C282.2 C283.2 C284.2 C285.2 C286.2 C287.2 C288.2 C289.2 C290.2 C291.2 C292.2 C293.2 C294.2 C295.2 C296.2 C297.2 C298.2 C299.2 C300.2 C301.2 C302.2 C303.2 C304.2 C305.2 C306.2 C307.2 C308.1 C309.2 C311.2 C313.2 C314.2 C315.2 C316.2 C317.2 C318.2 C319.2 C320.2 C321.2 C322.2 C323.2 C324.2 C325.2 D3.1(A1) D3.2(A2) D4.1(C) D5.1(C) D6.1(C) D7.1(C) J1.3 J2.2 J2.3 J3.5 J3.6 J3.7 J3.8 J3.9 J6.1 Q2.1(S) Q2.2(S) Q2.3(S) Q3.1(S) Q3.2(S) Q3.3(S) Q5.1(S) Q5.2(S) Q5.3(S) Q6.1(S) Q6.2(S) Q6.3(S) R33.1 R40.1 R45.1 R59.1 R60.1 R61.1 R67.1 U1.9(VSS) U1.20(AVSS) U1.25(VSS) U1.41(VSS) U2.5(DVSS0) U2.8(VSSA_PLL) U2.20(DVSS1) U2.23(OVSS1) U2.32(DVSS2) U2.38(OVSS0) U2.42(DVSS3) U2.49(EP) U3.5(DVSS0) U3.8(VSSA_PLL) U3.20(DVSS1) U3.23(OVSS1) U3.32(DVSS2) U3.38(OVSS0) U3.42(DVSS3) U3.49(EP) U4.5(DVSS0) U4.8(VSSA_PLL) U4.20(DVSS1) U4.23(OVSS1) U4.32(DVSS2) U4.38(OVSS0) U4.42(DVSS3) U4.49(EP) U5.5(DVSS0) U5.8(VSSA_PLL) U5.20(DVSS1) U5.23(OVSS1) U5.32(DVSS2) U5.38(OVSS0) U5.42(DVSS3) U5.49(EP) U6.2(GND) U7.5(DVSS0) U7.8(VSSA_PLL) U7.20(DVSS1) U7.23(OVSS1) U7.32(DVSS2) U7.38(OVSS0) U7.42(DVSS3) U7.49(EP) U8.5(DVSS0) U8.8(VSSA_PLL) U8.20(DVSS1) U8.23(OVSS1) U8.32(DVSS2) U8.38(OVSS0) U8.42(DVSS3) U8.49(EP) U9.5(DVSS0) U9.8(VSSA_PLL) U9.20(DVSS1) U9.23(OVSS1) U9.32(DVSS2) U9.38(OVSS0) U9.42(DVSS3) U9.49(EP) U10.5(DVSS0) U10.8(VSSA_PLL) U10.20(DVSS1) U10.23(OVSS1) U10.32(DVSS2) U10.38(OVSS0) U10.42(DVSS3) U10.49(EP) U11.5(DVSS0) U11.8(VSSA_PLL) U11.20(DVSS1) U11.23(OVSS1) U11.32(DVSS2) U11.38(OVSS0) U11.42(DVSS3) U11.49(EP) U12.5(DVSS0) U12.8(VSSA_PLL) U12.20(DVSS1) U12.23(OVSS1) U12.32(DVSS2) U12.38(OVSS0) U12.42(DVSS3) U12.49(EP) U13.5(DVSS0) U13.8(VSSA_PLL) U13.20(DVSS1) U13.23(OVSS1) U13.32(DVSS2) U13.38(OVSS0) U13.42(DVSS3) U13.49(EP) U14.5(DVSS0) U14.8(VSSA_PLL) U14.20(DVSS1) U14.23(OVSS1) U14.32(DVSS2) U14.38(OVSS0) U14.42(DVSS3) U14.49(EP) U15.5(DVSS0) U15.8(VSSA_PLL) U15.20(DVSS1) U15.23(OVSS1) U15.32(DVSS2) U15.38(OVSS0) U15.42(DVSS3) U15.49(EP) U16.5(DVSS0) U16.8(VSSA_PLL) U16.20(DVSS1) U16.23(OVSS1) U16.32(DVSS2) U16.38(OVSS0) U16.42(DVSS3) U16.49(EP) U17.5(DVSS0) U17.8(VSSA_PLL) U17.20(DVSS1) U17.23(OVSS1) U17.32(DVSS2) U17.38(OVSS0) U17.42(DVSS3) U17.49(EP) U18.5(DVSS0) U18.8(VSSA_PLL) U18.20(DVSS1) U18.23(OVSS1) U18.32(DVSS2) U18.38(OVSS0) U18.42(DVSS3) U18.49(EP) U19.6(GND) U19.7(GND) U21.3(Vdd) U21.8(Rs) U25.4(GND) U25.9(EP) U30.4(GND) U30.9(EP)
1.2V: C5.1 C6.1 C7.1 C8.1 C9.1 C10.1 C11.1 C12.1 C18.1 C19.1 C20.1 C21.1 C22.1 C23.1 C24.1 C25.1 C26.1 C27.1 C28.1 C29.1 C30.1 C31.1 C32.1 C33.1 C35.1 C36.1 C38.1 C39.1 C41.1 C42.1 C44.1 C45.1 C51.1 C52.1 C53.1 C54.1 C55.1 C56.1 C57.1 C58.1 C64.1 C65.1 C66.1 C67.1 C68.1 C69.1 C70.1 C71.1 C77.1 C78.1 C79.1 C80.1 C81.1 C82.1 C83.1 C84.1 C87.1 C88.1 C90.1 C91.1 C93.1 C94.1 C96.1 C97.1 C103.1 C104.1 C105.1 C106.1 C107.1 C108.1 C109.1 C110.1 C115.1 C116.1 C117.1 C118.1 C119.1 C120.1 C121.1 C122.1 C123.1 C124.1 C125.1 C126.1 C127.1 C128.1 C129.1 C130.1 C131.1 C132.1 C134.1 C135.1 C137.1 C138.1 C140.1 C141.1 C147.1 C148.1 C149.1 C150.1 C151.1 C152.1 C153.1 C154.1 C159.1 C160.1 C161.1 C162.1 C163.1 C164.1 C165.1 C166.1 C167.1 C168.1 C169.1 C170.1 C171.1 C172.1 C173.1 C174.1 C175.1 C176.1 C178.1 C179.1 C181.1 C182.1 C184.1 C185.1 C198.1 C199.1 C200.1 C201.1 C202.1 C203.1 C204.1 C205.1 C209.2 C212.1 C220.1 C221.1 C222.1 C223.1 C224.1 C225.1 C226.1 C227.1 C228.1 C232.1 C238.1 C239.1 C240.1 C241.1 C242.1 C243.1 C244.1 C245.1 C246.1 C247.1 C256.1 C257.1 C258.1 C259.1 C260.1 C261.1 C262.1 C271.1 C282.1 C283.1 C284.1 C285.1 C286.1 C287.1 C288.1 C289.1 C290.1 C291.1 C292.1 C293.1 C294.1 C295.1 C296.1 C297.1 C298.1 C299.1 C300.1 C301.1 C302.1 C303.1 C304.1 C305.1 C306.1 C307.1 C309.1 C313.1 C314.1 C315.1 C316.1 C317.1 C318.1 C319.1 C320.1 C321.1 C322.1 C323.1 C324.1 L1.2 L2.2 R38.2 R43.2 U2.3(DVDD26) U2.4(DVDD0) U2.6(DVDD5) U2.7(VDDA_PLL) U2.11(DVDD29) U2.12(DVDD8) U2.13(DVDD9) U2.14(DVDD30) U2.15(DVDD11) U2.16(DVDD12) U2.19(DVDD1) U2.21(DVDD14) U2.22(DVDD33) U2.25(DVDD15) U2.26(DVDD34) U2.27(DVDD17) U2.28(DVDD19) U2.31(DVDD2) U2.33(DVDD36) U2.34(DVDD37) U2.39(DVDD38) U2.40(DVDD20) U2.41(DVDD3) U2.43(DVDD23) U2.46(DVDD40) U2.47(DVDD41) U2.48(DVDD25) U3.3(DVDD26) U3.4(DVDD0) U3.6(DVDD5) U3.7(VDDA_PLL) U3.11(DVDD29) U3.12(DVDD8) U3.13(DVDD9) U3.14(DVDD30) U3.15(DVDD11) U3.16(DVDD12) U3.19(DVDD1) U3.21(DVDD14) U3.22(DVDD33) U3.25(DVDD15) U3.26(DVDD34) U3.27(DVDD17) U3.28(DVDD19) U3.31(DVDD2) U3.33(DVDD36) U3.34(DVDD37) U3.39(DVDD38) U3.40(DVDD20) U3.41(DVDD3) U3.43(DVDD23) U3.46(DVDD40) U3.47(DVDD41) U3.48(DVDD25) U4.3(DVDD26) U4.4(DVDD0) U4.6(DVDD5) U4.7(VDDA_PLL) U4.11(DVDD29) U4.12(DVDD8) U4.13(DVDD9) U4.14(DVDD30) U4.15(DVDD11) U4.16(DVDD12) U4.19(DVDD1) U4.21(DVDD14) U4.22(DVDD33) U4.25(DVDD15) U4.26(DVDD34) U4.27(DVDD17) U4.28(DVDD19) U4.31(DVDD2) U4.33(DVDD36) U4.34(DVDD37) U4.39(DVDD38) U4.40(DVDD20) U4.41(DVDD3) U4.43(DVDD23) U4.46(DVDD40) U4.47(DVDD41) U4.48(DVDD25) U5.3(DVDD26) U5.4(DVDD0) U5.6(DVDD5) U5.7(VDDA_PLL) U5.11(DVDD29) U5.12(DVDD8) U5.13(DVDD9) U5.14(DVDD30) U5.15(DVDD11) U5.16(DVDD12) U5.19(DVDD1) U5.21(DVDD14) U5.22(DVDD33) U5.25(DVDD15) U5.26(DVDD34) U5.27(DVDD17) U5.28(DVDD19) U5.31(DVDD2) U5.33(DVDD36) U5.34(DVDD37) U5.39(DVDD38) U5.40(DVDD20) U5.41(DVDD3) U5.43(DVDD23) U5.46(DVDD40) U5.47(DVDD41) U5.48(DVDD25) U7.3(DVDD26) U7.4(DVDD0) U7.6(DVDD5) U7.7(VDDA_PLL) U7.11(DVDD29) U7.12(DVDD8) U7.13(DVDD9) U7.14(DVDD30) U7.15(DVDD11) U7.16(DVDD12) U7.19(DVDD1) U7.21(DVDD14) U7.22(DVDD33) U7.25(DVDD15) U7.26(DVDD34) U7.27(DVDD17) U7.28(DVDD19) U7.31(DVDD2) U7.33(DVDD36) U7.34(DVDD37) U7.39(DVDD38) U7.40(DVDD20) U7.41(DVDD3) U7.43(DVDD23) U7.46(DVDD40) U7.47(DVDD41) U7.48(DVDD25) U8.3(DVDD26) U8.4(DVDD0) U8.6(DVDD5) U8.7(VDDA_PLL) U8.11(DVDD29) U8.12(DVDD8) U8.13(DVDD9) U8.14(DVDD30) U8.15(DVDD11) U8.16(DVDD12) U8.19(DVDD1) U8.21(DVDD14) U8.22(DVDD33) U8.25(DVDD15) U8.26(DVDD34) U8.27(DVDD17) U8.28(DVDD19) U8.31(DVDD2) U8.33(DVDD36) U8.34(DVDD37) U8.39(DVDD38) U8.40(DVDD20) U8.41(DVDD3) U8.43(DVDD23) U8.46(DVDD40) U8.47(DVDD41) U8.48(DVDD25) U9.3(DVDD26) U9.4(DVDD0) U9.6(DVDD5) U9.7(VDDA_PLL) U9.11(DVDD29) U9.12(DVDD8) U9.13(DVDD9) U9.14(DVDD30) U9.15(DVDD11) U9.16(DVDD12) U9.19(DVDD1) U9.21(DVDD14) U9.22(DVDD33) U9.25(DVDD15) U9.26(DVDD34) U9.27(DVDD17) U9.28(DVDD19) U9.31(DVDD2) U9.33(DVDD36) U9.34(DVDD37) U9.39(DVDD38) U9.40(DVDD20) U9.41(DVDD3) U9.43(DVDD23) U9.46(DVDD40) U9.47(DVDD41) U9.48(DVDD25) U10.3(DVDD26) U10.4(DVDD0) U10.6(DVDD5) U10.7(VDDA_PLL) U10.11(DVDD29) U10.12(DVDD8) U10.13(DVDD9) U10.14(DVDD30) U10.15(DVDD11) U10.16(DVDD12) U10.19(DVDD1) U10.21(DVDD14) U10.22(DVDD33) U10.25(DVDD15) U10.26(DVDD34) U10.27(DVDD17) U10.28(DVDD19) U10.31(DVDD2) U10.33(DVDD36) U10.34(DVDD37) U10.39(DVDD38) U10.40(DVDD20) U10.41(DVDD3) U10.43(DVDD23) U10.46(DVDD40) U10.47(DVDD41) U10.48(DVDD25) U11.3(DVDD26) U11.4(DVDD0) U11.6(DVDD5) U11.7(VDDA_PLL) U11.11(DVDD29) U11.12(DVDD8) U11.13(DVDD9) U11.14(DVDD30) U11.15(DVDD11) U11.16(DVDD12) U11.19(DVDD1) U11.21(DVDD14) U11.22(DVDD33) U11.25(DVDD15) U11.26(DVDD34) U11.27(DVDD17) U11.28(DVDD19) U11.31(DVDD2) U11.33(DVDD36) U11.34(DVDD37) U11.39(DVDD38) U11.40(DVDD20) U11.41(DVDD3) U11.43(DVDD23) U11.46(DVDD40) U11.47(DVDD41) U11.48(DVDD25) U12.3(DVDD26) U12.4(DVDD0) U12.6(DVDD5) U12.7(VDDA_PLL) U12.11(DVDD29) U12.12(DVDD8) U12.13(DVDD9) U12.14(DVDD30) U12.15(DVDD11) U12.16(DVDD12) U12.19(DVDD1) U12.21(DVDD14) U12.22(DVDD33) U12.25(DVDD15) U12.26(DVDD34) U12.27(DVDD17) U12.28(DVDD19) U12.31(DVDD2) U12.33(DVDD36) U12.34(DVDD37) U12.39(DVDD38) U12.40(DVDD20) U12.41(DVDD3) U12.43(DVDD23) U12.46(DVDD40) U12.47(DVDD41) U12.48(DVDD25) U13.3(DVDD26) U13.4(DVDD0) U13.6(DVDD5) U13.7(VDDA_PLL) U13.11(DVDD29) U13.12(DVDD8) U13.13(DVDD9) U13.14(DVDD30) U13.15(DVDD11) U13.16(DVDD12) U13.19(DVDD1) U13.21(DVDD14) U13.22(DVDD33) U13.25(DVDD15) U13.26(DVDD34) U13.27(DVDD17) U13.28(DVDD19) U13.31(DVDD2) U13.33(DVDD36) U13.34(DVDD37) U13.39(DVDD38) U13.40(DVDD20) U13.41(DVDD3) U13.43(DVDD23) U13.46(DVDD40) U13.47(DVDD41) U13.48(DVDD25) U14.3(DVDD26) U14.4(DVDD0) U14.6(DVDD5) U14.7(VDDA_PLL) U14.11(DVDD29) U14.12(DVDD8) U14.13(DVDD9) U14.14(DVDD30) U14.15(DVDD11) U14.16(DVDD12) U14.19(DVDD1) U14.21(DVDD14) U14.22(DVDD33) U14.25(DVDD15) U14.26(DVDD34) U14.27(DVDD17) U14.28(DVDD19) U14.31(DVDD2) U14.33(DVDD36) U14.34(DVDD37) U14.39(DVDD38) U14.40(DVDD20) U14.41(DVDD3) U14.43(DVDD23) U14.46(DVDD40) U14.47(DVDD41) U14.48(DVDD25) U15.3(DVDD26) U15.4(DVDD0) U15.6(DVDD5) U15.7(VDDA_PLL) U15.11(DVDD29) U15.12(DVDD8) U15.13(DVDD9) U15.14(DVDD30) U15.15(DVDD11) U15.16(DVDD12) U15.19(DVDD1) U15.21(DVDD14) U15.22(DVDD33) U15.25(DVDD15) U15.26(DVDD34) U15.27(DVDD17) U15.28(DVDD19) U15.31(DVDD2) U15.33(DVDD36) U15.34(DVDD37) U15.39(DVDD38) U15.40(DVDD20) U15.41(DVDD3) U15.43(DVDD23) U15.46(DVDD40) U15.47(DVDD41) U15.48(DVDD25) U16.3(DVDD26) U16.4(DVDD0) U16.6(DVDD5) U16.7(VDDA_PLL) U16.11(DVDD29) U16.12(DVDD8) U16.13(DVDD9) U16.14(DVDD30) U16.15(DVDD11) U16.16(DVDD12) U16.19(DVDD1) U16.21(DVDD14) U16.22(DVDD33) U16.25(DVDD15) U16.26(DVDD34) U16.27(DVDD17) U16.28(DVDD19) U16.31(DVDD2) U16.33(DVDD36) U16.34(DVDD37) U16.39(DVDD38) U16.40(DVDD20) U16.41(DVDD3) U16.43(DVDD23) U16.46(DVDD40) U16.47(DVDD41) U16.48(DVDD25) U17.3(DVDD26) U17.4(DVDD0) U17.6(DVDD5) U17.7(VDDA_PLL) U17.11(DVDD29) U17.12(DVDD8) U17.13(DVDD9) U17.14(DVDD30) U17.15(DVDD11) U17.16(DVDD12) U17.19(DVDD1) U17.21(DVDD14) U17.22(DVDD33) U17.25(DVDD15) U17.26(DVDD34) U17.27(DVDD17) U17.28(DVDD19) U17.31(DVDD2) U17.33(DVDD36) U17.34(DVDD37) U17.39(DVDD38) U17.40(DVDD20) U17.41(DVDD3) U17.43(DVDD23) U17.46(DVDD40) U17.47(DVDD41) U17.48(DVDD25) U18.3(DVDD26) U18.4(DVDD0) U18.6(DVDD5) U18.7(VDDA_PLL) U18.11(DVDD29) U18.12(DVDD8) U18.13(DVDD9) U18.14(DVDD30) U18.15(DVDD11) U18.16(DVDD12) U18.19(DVDD1) U18.21(DVDD14) U18.22(DVDD33) U18.25(DVDD15) U18.26(DVDD34) U18.27(DVDD17) U18.28(DVDD19) U18.31(DVDD2) U18.33(DVDD36) U18.34(DVDD37) U18.39(DVDD38) U18.40(DVDD20) U18.41(DVDD3) U18.43(DVDD23) U18.46(DVDD40) U18.47(DVDD41) U18.48(DVDD25)
3.3V: C13.1 C14.1 C15.1 C16.1 C34.1 C37.2 C40.2 C43.2 C46.2 C59.1 C60.1 C61.1 C62.1 C63.1 C73.1 C74.1 C75.1 C76.1 C89.2 C92.2 C95.2 C98.2 C111.1 C112.1 C113.1 C114.1 C133.2 C136.2 C139.2 C142.2 C155.1 C156.1 C157.1 C158.1 C177.2 C180.2 C183.2 C186.2 C211.1 C229.1 C233.1 C234.1 C235.1 C236.1 C237.1 C248.1 C249.1 C250.1 C252.1 C311.1 J1.2 R1.1 R2.1 R3.1 R4.1 R5.1 R6.1 R7.1 R8.1 R9.2 R10.1 R11.1 R12.1 R13.1 R14.1 R15.1 R16.1 R17.1 R48.1 R49.1 R50.1 R51.1 R52.2 R53.2 R54.2 R55.2 U1.10(VDD) U1.19(AVDD) U1.26(VDD) U1.35(VUSB3V3) U1.38(VDD) U1.57(VDD) U2.24(OVDD1) U2.37(OVDD0) U3.24(OVDD1) U3.37(OVDD0) U4.24(OVDD1) U4.37(OVDD0) U5.24(OVDD1) U5.37(OVDD0) U6.5(Vout) U7.24(OVDD1) U7.37(OVDD0) U8.24(OVDD1) U8.37(OVDD0) U9.24(OVDD1) U9.37(OVDD0) U10.24(OVDD1) U10.37(OVDD0) U11.24(OVDD1) U11.37(OVDD0) U12.24(OVDD1) U12.37(OVDD0) U13.24(OVDD1) U13.37(OVDD0) U14.24(OVDD1) U14.37(OVDD0) U15.24(OVDD1) U15.37(OVDD0) U16.24(OVDD1) U16.37(OVDD0) U17.24(OVDD1) U17.37(OVDD0) U18.24(OVDD1) U18.37(OVDD0) U19.1(OUTPUT) U25.6(Vlogic) U30.6(Vlogic)
5.0V: C188.2 C231.1 C308.2 D1.1(A1) D1.2(A2) D2.1(A1) D2.2(A2) R42.1 R63.1 U20.3(Vin) U22.1(OUTPUT) U23.3(Vin) U25.7(VCC) U30.7(VCC)
5.0V PS: J2.4 R42.2
12V: C190.1 C191.1 C192.1 C193.1 C194.1 C195.1 C196.1 C197.1 C207.1 C208.1 C210.1 C213.1 C214.1 C215.1 C216.1 C217.1 C218.1 C219.1 C230.1 C263.1 C264.1 C265.1 C266.1 C267.1 C268.1 C269.1 C270.1 C272.1 C273.1 C274.1 C275.1 C276.1 C277.1 C278.1 C279.1 C280.1 C281.1 J2.1 J6.2 Q1.5(D) Q1.6(D) Q1.7(D) Q1.8(D) Q4.5(D) Q4.6(D) Q4.7(D) Q4.8(D) R57.1 U20.1(Vout) U22.8(INPUT) U23.1(Vout)
BOOT3: C312.1 D2.3(CC) U30.8(BOOT)
BOOT4: C189.1 D1.3(CC) U25.8(BOOT)
C1Rx: U1.58(VCMPST1/RP96/RF0) U21.4(Rx)
C1Tx: U1.59(VCMPST2/RP97/RF1) U21.1(Tx)
C_CLK_OUT1: U2.44(CORE_CLKOUT)
C_CLK_OUT2: U3.44(CORE_CLKOUT)
C_CLK_OUT3: U4.44(CORE_CLKOUT)
C_CLK_OUT4: U5.44(CORE_CLKOUT)
C_CLK_OUT5: U7.44(CORE_CLKOUT)
C_CLK_OUT6: U8.44(CORE_CLKOUT)
C_CLK_OUT7: U9.44(CORE_CLKOUT)
C_CLK_OUT8: U10.44(CORE_CLKOUT)
C_CLK_OUT9: U11.44(CORE_CLKOUT)
C_CLK_OUT10: U12.44(CORE_CLKOUT)
C_CLK_OUT11: U13.44(CORE_CLKOUT)
C_CLK_OUT12: U14.44(CORE_CLKOUT)
C_CLK_OUT13: U15.44(CORE_CLKOUT)
C_CLK_OUT14: U16.44(CORE_CLKOUT)
C_CLK_OUT15: U17.44(CORE_CLKOUT)
C_CLK_OUT16: U18.44(CORE_CLKOUT)
CAN5.0V: C255.1 R47.1 R64.1 U21.2(GND)
CANH: J4.1 J5.2 U21.7(CANH)
CANL: J5.1 R41.2 U21.6(CANL)
CONFIG_N1: U1.42(RTCC/DMLN/RPI72/RD8) U2.2(CONFIG_NI)
CONFIG_N2: U2.35(CONFIG_NO) U3.2(CONFIG_NI)
CONFIG_N3: U3.35(CONFIG_NO) U4.2(CONFIG_NI)
CONFIG_N4: U4.35(CONFIG_NO) U5.2(CONFIG_NI)
CONFIG_N5: R21.1 R21.2 U5.35(CONFIG_NO) U7.2(CONFIG_NI)
CONFIG_N6: U7.35(CONFIG_NO) U8.2(CONFIG_NI)
CONFIG_N7: U8.35(CONFIG_NO) U9.2(CONFIG_NI)
CONFIG_N8: U9.35(CONFIG_NO) U10.2(CONFIG_NI)
CONFIG_N9: R25.2 U10.35(CONFIG_NO)
CONFIG_N9I: R25.1 U1.54(C3IN2-/RP70/RD6) U11.2(CONFIG_NI)
CONFIG_N10: U11.35(CONFIG_NO) U12.2(CONFIG_NI)
CONFIG_N11: U12.35(CONFIG_NO) U13.2(CONFIG_NI)
CONFIG_N12: U13.35(CONFIG_NO) U14.2(CONFIG_NI)
CONFIG_N13: R29.1 R29.2 U14.35(CONFIG_NO) U15.2(CONFIG_NI)
CONFIG_N14: U15.35(CONFIG_NO) U16.2(CONFIG_NI)
CONFIG_N15: U16.35(CONFIG_NO) U17.2(CONFIG_NI)
CONFIG_N16: U17.35(CONFIG_NO) U18.2(CONFIG_NI)
CONFIG_N17: U18.35(CONFIG_NO)
CONFIG_P1: U1.43(ASDA1/DPLN/RPI73/RD9) U2.1(CONFIG_PI)
CONFIG_P2: U2.36(CONFIG_PO) U3.1(CONFIG_PI)
CONFIG_P3: U3.36(CONFIG_PO) U4.1(CONFIG_PI)
CONFIG_P4: U4.36(CONFIG_PO) U5.1(CONFIG_PI)
CONFIG_P5: R20.1 R20.2 U5.36(CONFIG_PO) U7.1(CONFIG_PI)
CONFIG_P6: U7.36(CONFIG_PO) U8.1(CONFIG_PI)
CONFIG_P7: U8.36(CONFIG_PO) U9.1(CONFIG_PI)
CONFIG_P8: U9.36(CONFIG_PO) U10.1(CONFIG_PI)
CONFIG_P9: R24.2 U10.36(CONFIG_PO)
CONFIG_P9I: R24.1 U1.55(C3IN1+/VCMPST3/RP71/RD7) U11.1(CONFIG_PI)
CONFIG_P10: U11.36(CONFIG_PO) U12.1(CONFIG_PI)
CONFIG_P11: U12.36(CONFIG_PO) U13.1(CONFIG_PI)
CONFIG_P12: U13.36(CONFIG_PO) U14.1(CONFIG_PI)
CONFIG_P13: R28.1 R28.2 U14.36(CONFIG_PO) U15.1(CONFIG_PI)
CONFIG_P14: U15.36(CONFIG_PO) U16.1(CONFIG_PI)
CONFIG_P15: U16.36(CONFIG_PO) U17.1(CONFIG_PI)
CONFIG_P16: U17.36(CONFIG_PO) U18.1(CONFIG_PI)
CONFIG_P17: U18.36(CONFIG_PO)
CSN4: R38.1 U1.14(AN2/C2IN2-/VMIO/RPI34/RB2)
CSP4: R37.1 U1.13(AN3/C2IN1+/VPIO/RPI35/RB3)
D+: C254.2 R35.2 U1.37(D+/RG2)
D-: C253.2 R34.2 U1.36(D-/RG3)
DBG_N1: U2.30(DBG0)
DBG_N2: U3.30(DBG0)
DBG_N3: U4.30(DBG0)
DBG_N4: U5.30(DBG0)
DBG_N5: U7.30(DBG0)
DBG_N6: U8.30(DBG0)
DBG_N7: U9.30(DBG0)
DBG_N8: U10.30(DBG0)
DBG_N9: U11.30(DBG0)
DBG_N10: U12.30(DBG0)
DBG_N11: U13.30(DBG0)
DBG_N12: U14.30(DBG0)
DBG_N13: U15.30(DBG0)
DBG_N14: U16.30(DBG0)
DBG_N15: U17.30(DBG0)
DBG_N16: U18.30(DBG0)
DBG_P1: U2.29(DBG1)
DBG_P2: U3.29(DBG1)
DBG_P3: U4.29(DBG1)
DBG_P4: U5.29(DBG1)
DBG_P5: U7.29(DBG1)
DBG_P6: U8.29(DBG1)
DBG_P7: U9.29(DBG1)
DBG_P8: U10.29(DBG1)
DBG_P9: U11.29(DBG1)
DBG_P10: U12.29(DBG1)
DBG_P11: U13.29(DBG1)
DBG_P12: U14.29(DBG1)
DBG_P13: U15.29(DBG1)
DBG_P14: U16.29(DBG1)
DBG_P15: U17.29(DBG1)
DBG_P16: U18.29(DBG1)
FAN5.0V: R63.2 R64.2
FB: C251.1 R43.1 U1.17(PGEC1/AN6/RPI38/RB6)
GREEN: D5.2(A) U1.62(AN26/PWM2L/PMD2/RP82/RE2)
HO3: Q4.4(G) U30.1(HO)
HO4: Q1.4(G) U25.1(HO)
LDO5.0V: C187.1 R46.1 R47.2 R62.2 U6.1(Vin) U6.3(STBY) U19.5(N.C.) U19.8(INPUT)
LMGND: D3.3(CC) R60.2 U20.2(GND) U22.2(GND) U22.3(GND) U22.4(N.C.) U22.5(N.C.) U22.6(GND) U22.7(GND) U23.2(GND)
LO3: Q5.4(G) Q6.4(G) U30.3(LO)
LO4: Q2.4(G) Q3.4(G) U25.3(LO)
Main OSC In: C85.1 U1.39(OSC1/RPI60/RC12) Y1.1
Main OSC Out: C86.1 U1.40(OSC2/CLKO/RC15) Y1.2
MCLR: C72.1 J1.1 R9.1 U1.7(MCLR)
MEAS12: C325.1 R57.2 R61.2 U1.18(PGED1/AN7/RCV/RPI39/RB7)
ORANGE: D7.2(A) U1.45(PMCS1/RPI75/RD11)
PGC: J1.5 U1.15(PGEC3/AN1/VREF-/RPI33/RB1)
PGD: J1.4 U1.16(PGED3/AN0/VREF+/RPI32/RB0)
PWM: J6.4 U1.61(AN25/PWM1H/PMD1/RPI81/RE1)
PWM3H: R59.2 U1.1(AN29/PWM3H/PMD5/RP85/RE5) U30.5(IN)
PWM3L: U1.64(AN28/PWM3L/PMD4/RP84/RE4)
PWM4H: R40.2 U1.3(AN31/PWM4H/PMD7/RP87/RE7) U25.5(IN)
PWM4L: U1.2(AN30/PWM4L/PMD6/RPI86/RE6)
RED: D4.2(A) U1.63(AN27/PWM2H/PMD3/RPI83/RE3)
REPORT_N1-4: R18.2 R22.2 R50.2 U1.48(PGEC2/SOSCO/C3IN1-/T1CK/RPI62/RC14) U2.17(REPORT_N) U3.17(REPORT_N) U4.17(REPORT_N) U5.17(REPORT_N)
REPORT_N5-8: R18.1 R49.2 U1.50(DPH/RP66/RD2) U7.17(REPORT_N) U8.17(REPORT_N) U9.17(REPORT_N) U10.17(REPORT_N)
REPORT_N9-12: R26.2 R55.1 U1.30(AN15/PMA0/RPI47/RB15) U11.17(REPORT_N) U12.17(REPORT_N) U13.17(REPORT_N) U14.17(REPORT_N)
REPORT_N13-16: R22.1 R26.1 R54.1 U1.29(AN14/PMA1/RPI46/RB14) U15.17(REPORT_N) U16.17(REPORT_N) U17.17(REPORT_N) U18.17(REPORT_N)
REPORT_P1-4: R19.2 R23.2 R51.2 U1.47(PGED2/SOSCI/C3IN3-/RPI61/RC13) U2.18(REPORT_P) U3.18(REPORT_P) U4.18(REPORT_P) U5.18(REPORT_P)
REPORT_P5-8: R19.1 R48.2 U1.51(PMBE/RP67/RD3) U7.18(REPORT_P) U8.18(REPORT_P) U9.18(REPORT_P) U10.18(REPORT_P)
REPORT_P9-12: R27.2 R53.1 U1.28(TDI/AN13/PMA10/RPI45/RB13) U11.18(REPORT_P) U12.18(REPORT_P) U13.18(REPORT_P) U14.18(REPORT_P)
REPORT_P13-16: R23.1 R27.1 R52.1 U1.27(TCK/AN12/PMA11/RPI44/RB12) U15.18(REPORT_P) U16.18(REPORT_P) U17.18(REPORT_P) U18.18(REPORT_P)
RESET1: C1.1 R1.2 U2.45(RSTN)
RESET2: C2.1 R2.2 U3.45(RSTN)
RESET3: C3.1 R3.2 U4.45(RSTN)
RESET4: C4.1 R4.2 U5.45(RSTN)
RESET5: C47.1 R5.2 U7.45(RSTN)
RESET6: C48.1 R6.2 U8.45(RSTN)
RESET7: C49.1 R7.2 U9.45(RSTN)
RESET8: C50.1 R8.2 U10.45(RSTN)
RESET9: C99.1 R10.2 U11.45(RSTN)
RESET10: C100.1 R11.2 U12.45(RSTN)
RESET11: C101.1 R12.2 U13.45(RSTN)
RESET12: C102.1 R13.2 U14.45(RSTN)
RESET13: C143.1 R14.2 U15.45(RSTN)
RESET14: C144.1 R15.2 U16.45(RSTN)
RESET15: C145.1 R16.2 U17.45(RSTN)
RESET16: C146.1 R17.2 U18.45(RSTN)
RPM: R44.1 R45.2 U1.60(AN24/PWM1L/PMD0/RP80/RE0)
RPMF: J6.3 R44.2
SWN3: C310.1 C312.2 L2.1 Q4.1(S) Q4.2(S) Q4.3(S) Q5.5(D) Q5.6(D) Q5.7(D) Q5.8(D) Q6.5(D) Q6.6(D) Q6.7(D) Q6.8(D) U30.2(SW)
SWN4: C189.2 C206.1 L1.1 Q1.1(S) Q1.2(S) Q1.3(S) Q2.5(D) Q2.6(D) Q2.7(D) Q2.8(D) Q3.5(D) Q3.6(D) Q3.7(D) Q3.8(D) R36.2 U25.2(SW)
U2Rx: U1.31(SDA2/PMA9/RP100/RF4)
U2Tx: U1.32(SCL2/PMA8/RP101/RF5)
USB5.0V: J3.1 R46.2 R56.2
USBDM/D-: J3.2 R34.1
USBDP/D+: J3.3 R35.1
USBMCU5.0V: R56.1 R62.1 U1.34(VBUS)
VCAP: C17.1 U1.56(VCAP)
XCLK1: U1.46(INT0/DMH/RP64/RD0) U2.9(XCLKIN)
XCLK2: U2.10(CLKOUT) U3.9(XCLKIN)
XCLK3: U3.10(CLKOUT) U4.9(XCLKIN)
XCLK4: U4.10(CLKOUT) U5.9(XCLKIN)
XCLK5: R30.1 R30.2 U5.10(CLKOUT) U7.9(XCLKIN)
XCLK6: U7.10(CLKOUT) U8.9(XCLKIN)
XCLK7: U8.10(CLKOUT) U9.9(XCLKIN)
XCLK8: U9.10(CLKOUT) U10.9(XCLKIN)
XCLK9: R31.2 U10.10(CLKOUT)
XCLK9I: R31.1 U1.49(VCPCON/RP65/RD1) U11.9(XCLKIN)
XCLK10: U11.10(CLKOUT) U12.9(XCLKIN)
XCLK11: U12.10(CLKOUT) U13.9(XCLKIN)
XCLK12: U13.10(CLKOUT) U14.9(XCLKIN)
XCLK13: R32.1 R32.2 U14.10(CLKOUT) U15.9(XCLKIN)
XCLK14: U15.10(CLKOUT) U16.9(XCLKIN)
XCLK15: U16.10(CLKOUT) U17.9(XCLKIN)
XCLK16: U17.10(CLKOUT) U18.9(XCLKIN)
XCLK17: U18.10(CLKOUT)
YELLOW: D6.2(A) U1.44(ASCL1/PMCS2/RPI74/RD10)
NetC206_2: C206.2 R33.2
NetC209_1: C209.1 R36.1 R37.2
NetC310_2: C310.2 R67.2
NetJ4_2: J4.2 R41.1

Not connected (* = marked no-connect by the designer): J3 4; U1 4(C1IN3-/SCK2/PMA5/RP118/RG6) 5(C1IN1-/SDI2/PMA4/RPI119/RG7) 6(C2IN3-/SDO2/PMA3/RP120/RG8) 8(C2IN1-/PMA2/RPI121/RG9) 11(AN5/C1IN1+/VBUSON/VBUSST/RPI37/RB5) 12(AN4/C1IN2-/USBOEN/RPI36/RB4) 21(AN8/PMA6/RPI40/RB8) 22(AN9/PMA7//RPI41/RB9) 23(TMS/AN10/CVREF/PMA13/RPI42/RB10) 24(TDO/AN11/PMA12/RPI43/RB11) 33(USBID/RP99/RF3) 52(PMWR/RP68/RD4) 53(PMRD/RP69/RD5); U6 4(NC); U19 2(GND) 3(GND) 4(N.C.); U21 5(Vref)

## Notes on the sheet
- Swapped XCLK1 and XCLK9I
- MCU Pins
- (in symbol C_POL) +
- (in symbol CON_USB_MINI_1) gnd

## Library data of the parts
C1-C16 C18-C33 C35-C62 C64-C71 C77-C84 C87-C186 = Cap Semi: Capacitor (Semiconductor SIM Model); Published: 8-Jun-2000; LatestRevisionDate: 29-May-2009; LatestRevisionNote: IPC-7351 Footprint Added.; PackageReference: C1206; Publisher: Altium Limited; PackageDescription: Chip Capacitor; Value: 470nF
C17 C34 C63 C72-C76 C85 C86 C187-C207 C209 C211 C213-C227 C229-C231 C233-C237 C240-C255 C258-C270 C273-C280 C283-C306 C308 C310-C312 C314-C325 = CAP: Capacitor
C208 C210 C212 C228 C232 C238 C239 C256 C257 C271 C272 C281 C282 C307 C309 C313 = C_POL: NOTE: <NOTE>
D1-D3 = D_DUAL_A1A2CC3: NOTE: <NOTE>
D4-D7 = LED_2: NOTE: <NOTE>
J1 = CON5: Connector
J2 J6 = CON_4PINS
J3 = CON_USB_MINI_1: NOTE: <NOTE>
J4 J5 = CON2: Connector
L1 L2 = L
Q1-Q6 = MOS_N_D1_S1S2S3G4D5D6D7D8: NOTE: <NOTE>
R1-R38 R40-R57 R59-R64 R67 = Res3: Resistor; Published: 8-Jun-2000; LatestRevisionDate: 29-May-2009; LatestRevisionNote: IPC-7351 Footprint Added.; PackageReference: J1-0603; Publisher: Altium Limited; PackageDescription: Chip Resistor
  R1-R8 R10-R17: Value: 100K
  R9 R40 R43 R44 R57 R59: Value: 10k
  R18 R19 R22-R27 R46 R47 R56 R60 R63 R64: Value: 0
  R20 R21 R28-R32 R42 R62: Value: (OPT)0
  R33 R67: Value: (OPT) 3.01
  R34 R35: Value: 27
  R36: Value: 768
  R37 R38 R45 R61: Value: 2.4k
  R41: Value: 120
  R48 R49 R52-R55: Value: (OPT)470
  R50 R51: Value: 470
U2-U5 U7-U18 = A3256Q48: Avalon SHA256
U6 = VOLTREG LDO
U19 U22 = IC_LM2931AD-5.0R2G_SO-8
U20 U23 = IC_Vout1GND2Vin3: NOTE: <NOTE>
U21 = MCP2551: CAN Driver
U25 U30 = DRVFET_LTC4442: Mosfet 12V Dual Bootstrapped PWM Sync Buck Optimised
Y1 = CRYSTAL